# Altium schematic sheet low_pass_filter.SchDoc
size A4
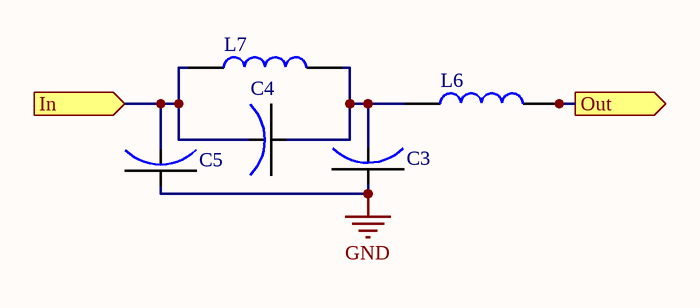
[diagram p0: low_pass_filter.SchDoc]

## Parts
C3  Cap  [C1206]  (value not drawn)
C4  Cap  [C1812]  (value not drawn)
C5  Cap  [C1812]  (value not drawn)
L6  L1812  [L1812]  (value not drawn)
L7  L1812  [L1812]  (value not drawn)

## Ports
In (in), Out (out)

## Nets
GND: C3.2 C5.2
In: C4.1 C5.1 L7.1 ; port In
Out: L6.2 ; port Out
NetC3_1: C3.1 C4.2 L6.1 L7.2

## Library data of the parts
L6 L7 = L1812: Vishay IMC1812ER150J